# EAGLE design opt_sensor (EAGLE 9.1.3)
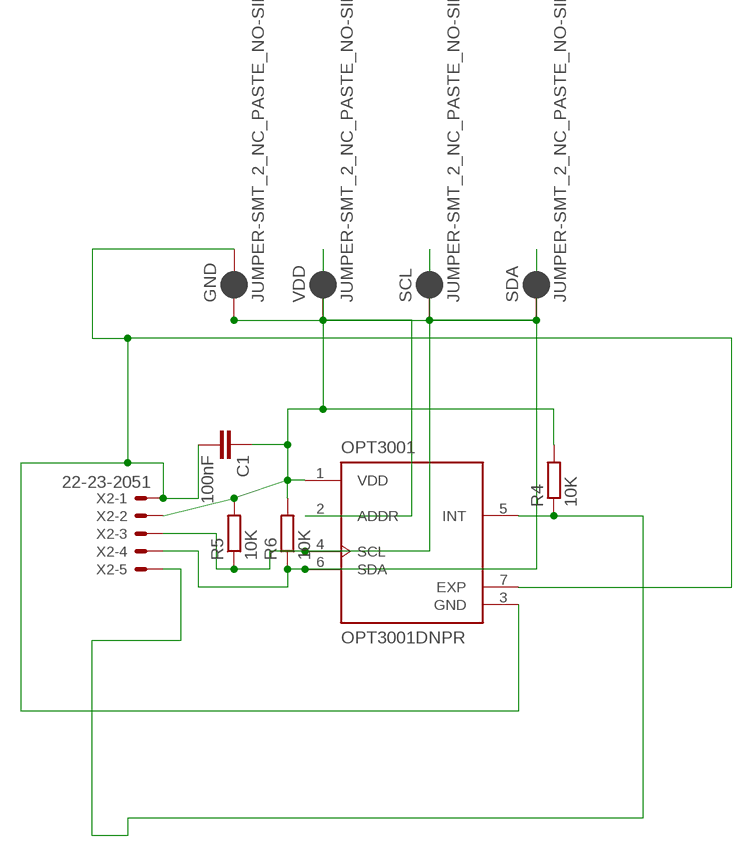
[diagram p0: schematic, sheet 1]

## Parts
C1  100nF  C-EUC0603  [C0603]
GND  JUMPER-SMT_2_NC_PASTE_NO-SILK  [SMT-JUMPER_2_NC_PASTE_NO-SILK]
OPT3001  OPT3001DNPR  [SON65P200X200X65-7N]
R4  10K  R-EU_R0402  [R0402]
R5  10K  R-EU_R0402  [R0402]
R6  10K  R-EU_R0402  [R0402]
SCL  JUMPER-SMT_2_NC_PASTE_NO-SILK  [SMT-JUMPER_2_NC_PASTE_NO-SILK]
SDA  JUMPER-SMT_2_NC_PASTE_NO-SILK  [SMT-JUMPER_2_NC_PASTE_NO-SILK]
VDD  JUMPER-SMT_2_NC_PASTE_NO-SILK  [SMT-JUMPER_2_NC_PASTE_NO-SILK]
X2  22-23-2051  [22-23-2051]

## Nets
ADD: GND.1 OPT3001.2(ADDR) SCL.1 SDA.1 VDD.1
GND: C1.2 GND.2 OPT3001.3(GND) OPT3001.7(EXP) X2.1
INT: OPT3001.5(INT) R4.1 X2.5
SCL: OPT3001.4(SCL) R5.1 SCL.2 X2.3
SDA: OPT3001.6(SDA) R6.1 SDA.2 X2.4
VDD: C1.1 OPT3001.1(VDD) R4.2 R5.2 R6.2 VDD.2 X2.2

## Library data of the parts
C1 = resistor:C-EU: CAPACITOR, European symbol
GND SCL SDA VDD = SparkFun-Jumpers:JUMPER-SMT_2_NC_PASTE: Normally closed solder jumper This jumper has an aperture in the stencil to allow solder paste to bridge the split in the wire so it's normally closed (NC). Wick off the solder to open the connection. Reapply solder to reclose the connection.
OPT3001 = OPT3001DNPR:OPT3001DNPR: Optical Sensor Ambient 550nm I²C 6-UDFN Exposed Pad Buy Part <https://snapeda.com/parts/OPT3001DNPR/Texas%20Instruments/view-part/?ref=eda> Check availability <https://pricing.snapeda.com/parts/OPT3001DNPR/Texas%20Instruments/view-part?ref=eda>; AVAILABILITY: In Stock; DESCRIPTION: Digital ambient light sensor (ALS) with high-precision human-eye response; MF: Texas Instruments; MP: OPT3001DNPR; PACKAGE: USON-6 Texas Instruments; PRICE: None; PURCHASE-URL: https://pricing.snapeda.com/search/part/OPT3001DNPR/?ref=eda
R4-R6 = resistor:R-EU_: RESISTOR, European symbol
X2 = con-molex:22-23-2051: .100" (2.54mm) Center Header - 5 Pin; MF: MOLEX; MPN: 22-23-2051; OC_FARNELL: 1462952; OC_NEWARK: 38C9178

## Board
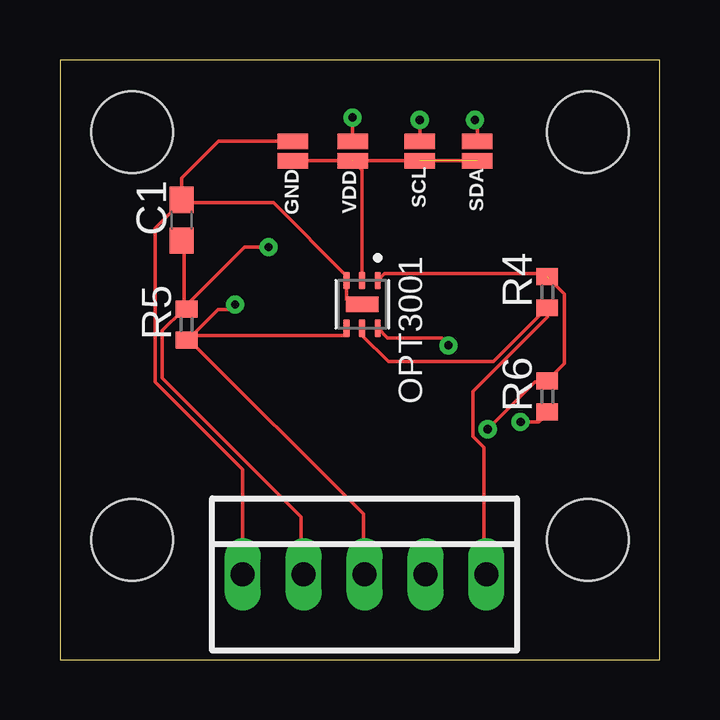
[diagram p1: board, top side]
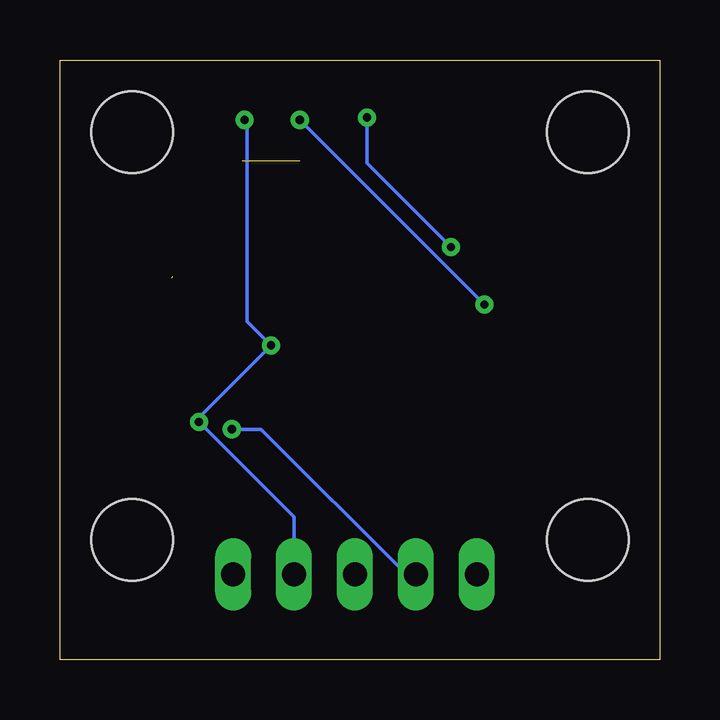
[diagram p2: board, bottom side, seen from below]

Size 25 x 25 mm. Coordinates in mm from the lower left corner, seen from the top.
Outline: 0,0 25,0 25,25 0,25 0,0
Copper layers (1*16): Top 0.035mm / dielectric 1.5mm / Bottom 0.035mm
Design rules "default": minimum track width 6mil, minimum drill 0.35mm, track to track 6mil, track to pad 6mil, pad to pad 6mil, via to via 6mil, smd to smd 6mil, copper to edge 40mil, drill to drill 6mil, minimum pad ring 10mil, minimum via ring 8mil, stop-mask expansion 4mil, vias tented up to drill 0mil, thermal gap 10mil
Holes 3.4 mm at 3,5 22,5 3,22 22,22

### Footprints (pad centres in the part's own frame; a part is rotated, then mirrored left to right if it is on the bottom)
C0603 = smd 1.1 x 1: 1 -0.85,0; 2 0.85,0
SMT-JUMPER_2_NC_PASTE_NO-SILK = smd 0.635 x 1.27: 1 -0.406,0; 2 0.406,0
SON65P200X200X65-7N = smd 0.74 x 0.27: 1 -0.995,0.65; 2 -0.995,0; 3 -0.995,-0.65; 4 0.995,-0.65; 5 0.995,0; 6 0.995,0.65 | smd 0.65 x 1.35: 7 0,0
R0402 = smd 0.7 x 0.9: 1 -0.65,0; 2 0.65,0
22-23-2051 = drill 1 long: 1 -5.08,0; 2 -2.54,0; 3 0,0; 4 2.54,0; 5 5.08,0

### Placement (x,y rotation side)
C1  5.08,18.32 90 top
GND  9.7,21.2 90 top
OPT3001  12.6,14.81 270 top
R4  20.32,15.32 90 top
R5  5.28,13.97 90 top
R6  20.32,10.97 90 top
SCL  15,21.2 90 top
SDA  17.4,21.2 90 top
VDD  12.2,21.2 90 top
X2  12.7,3.55 0 top

### Tracks (layer width: path | path; a pad name or v marks a point on that pad's centre or on a via)
ADD  (2 unrouted)
  Top 0.152: OPT3001.2 12.6,20.4 VDD.1 GND.1 SDA.1
GND
  Top 0.152: C1.2 5.18,19.05 8.9,19.05 11.95,16 OPT3001.3 11.95,15.02 12.16,14.81 OPT3001.7 | C1.2 5.03,19.05 3.96,17.98 3.96,11.58 7.62,7.92 7.62,4.05 7.62,3.65 X2.1 | C1.2 5.08,20.08 6.61,21.61 GND.2
INT
  Top 0.152: X2.5 17.68,3.64 17.68,8.84 17.22,9.3 17.22,11.18 20.32,14.28 R4.1 20.22,14.57 18.08,12.43 13.69,12.43 12.6,13.52 OPT3001.5
SCL  (via drill 0.35)
  Top 0.152: OPT3001.4 11.95,13.51 10.4,13.51 5.61,13.51 5.51,13.41 | 5.38,13.41 5.67,13.67 6.6,14.6 7.1,14.6 v7.3,14.8 | X2.3 12.65,3.64 12.65,6.07 5.31,13.41 5.38,13.41 | 5.38,13.41 5.51,13.41 | 5.38,13.41 5.51,13.41 | SCL.2 v15,22.5 | 5.38,13.41 R5.1
  Bottom 0.152: v15,22.5 v7.3,14.8
SDA  (via drill 0.35)
  Top 0.152: v19.2,9.91 19.96,9.91 20.27,10.21 R6.1 | v16.2,13.1 16.2,13.14 15.93,13.41 13.65,13.41 OPT3001.6 | SDA.2 17.4,22.4 v17.3,22.5
  Bottom 0.152: v17.3,22.5 17.2,22.4 17.2,14.1 16.8,13.7 v16.2,13.1 19.2,10.1 v19.2,9.91 15.24,5.94 15.24,3.44 15.24,4.35 X2.4
VDD  (via drill 0.35)  (1 unrouted)
  Top 0.152: OPT3001.1 13.54,16.09 20.16,16.09 20.34,15.91 | v17.83,9.6 19.81,11.58 20.27,11.58 R6.2 20.42,11.73 21.03,12.34 21.03,15.24 20.42,15.85 R4.2 | 5.18,14.8 5.18,15.8 5.18,17.37 C1.1 | X2.2 10.06,3.64 10.06,5.94 4.27,11.73 4.27,13.72 5.11,14.56 R5.2 5.18,14.63 5.18,14.7 5.18,14.8 | 5.18,14.8 5.3,14.8 7.7,17.2 v8.7,17.2 | v12.2,22.6 VDD.2
  Bottom 0.152: v8.7,17.2 12.2,20.7 v12.2,22.6 | X2.2 10.56,3.55 16.61,9.6 v17.83,9.6